# Altium schematic sheet 555 Timer.SchDoc: PCB Workshop
size A4; Revision: 1.1; SheetNumber: 1; SheetTotal: 1; Designer: Martin B; Project: PSAT; Design Name: 555 Timer; BoardRevision: 1.1; DesignName: 555 Timer
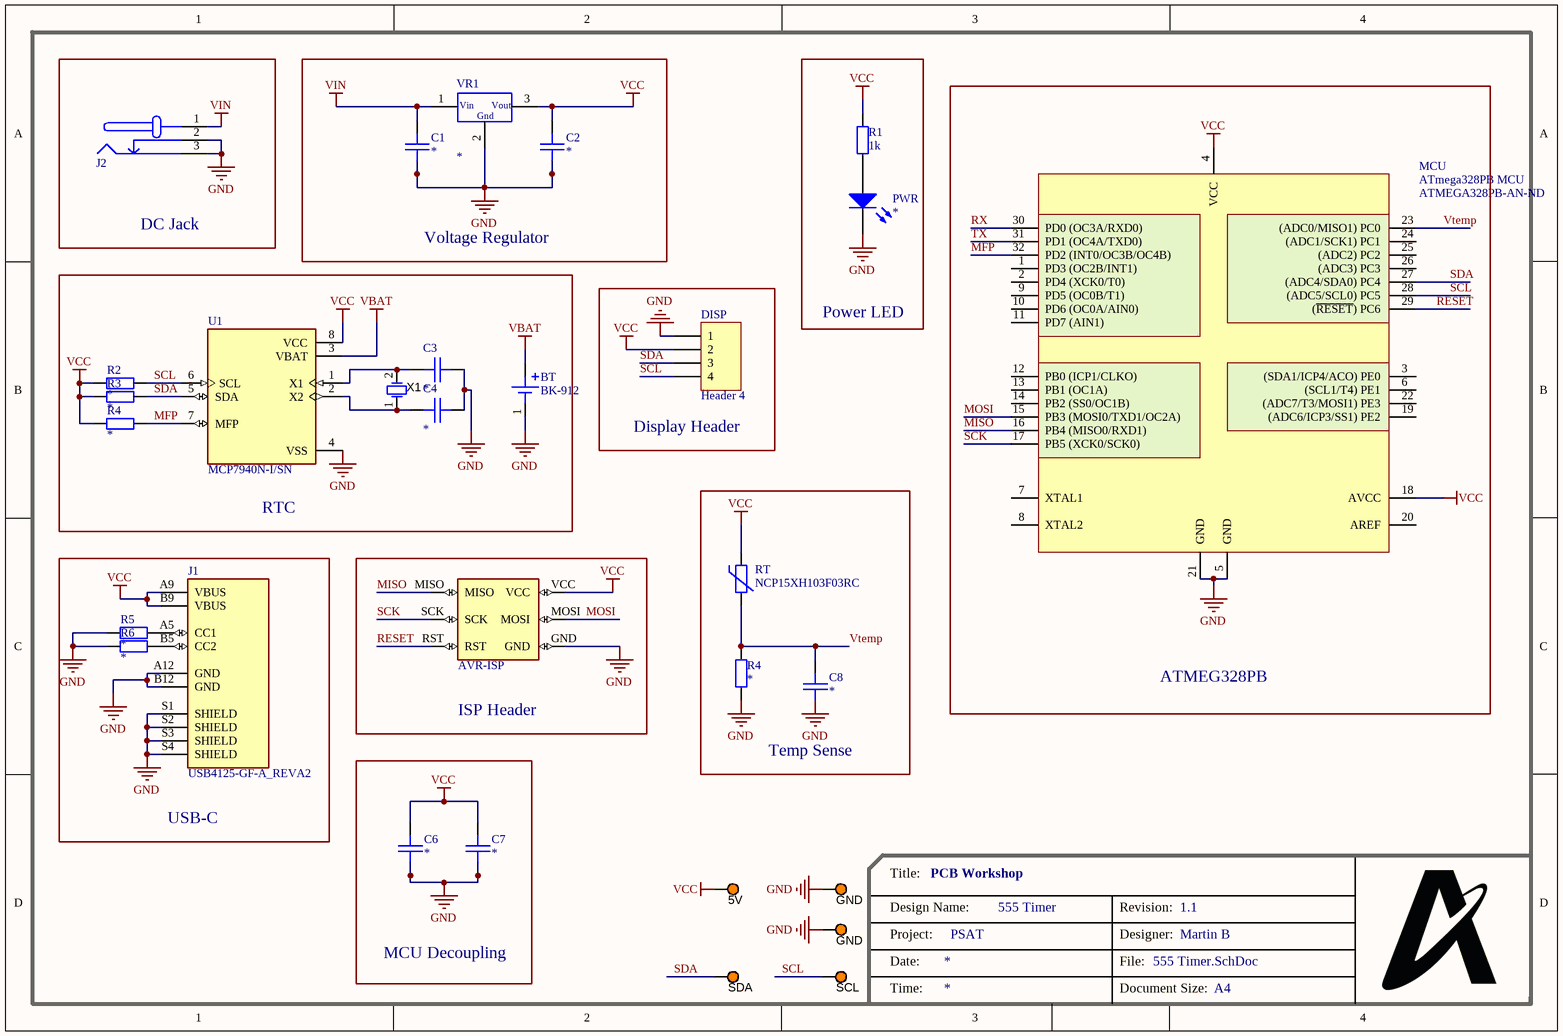
[diagram p0: 555 Timer.SchDoc]

## Parts
(Parts that share a designator on the sheet are numbered #1, #2 ... from top to bottom, then left to right.)
5V  5003  [TP_TH]  (value not drawn)
?  AVR-ISP  [AVR-ISP]
BT  BK-912  [BAT_BK-912]
C1  *  [0805 CAP]
C2  *  [0805 CAP]
C3  *  [0805 CAP]
C4  *  [0805 CAP]
C6  *  [0805 CAP]
C7  *  [0805 CAP]
C8  *  [0805 CAP]
DISP  Header 4  [ece-HDR1X4]
GND#1  5003  [TP_TH]  (value not drawn)
GND#2  5003  [TP_TH]  (value not drawn)
J1  USB4125-GF-A_REVA2  [GCT_USB4125-GF-A_REVA2]
J2  DC barrel jack  [AC-Socket]  (value not drawn)
MCU  ATmega328PB MCU  Supplier Part Number 1: ATMEGA328PB-AN-ND  [32 - TQFP]
PWR  *  [ECE-LED2012-0805SM]
R1  1k  [RESC2012-0805SM]
R2  *  [0805 RES]
R3  *  [0805 RES]
R4#1  *  [0805 RES]
R4#2  *  [0805 RES]
R5  *  [0805 RES]
R6  *  [0805 RES]
RT  NCP15XH103F03RC  [THRMC1005X55N]
SCL  5003  [TP_TH]  (value not drawn)
SDA  5003  [TP_TH]  (value not drawn)
U1  MCP7940N-I/SN  [SOIC127P600X175-8N]
VR1  *  [ece-TO220]
X1  ABS07-32.768KHz-T  [ABRA-ABS07-2_V]  (value not drawn)

## Blocks framed on the sheet
DC Jack: J2
Voltage Regulator: C1 C2 VR1
Power LED: PWR R1
ATMEG328PB: MCU
RTC: BT C3 C4 R2 R3 R4#1 U1 X1
Display Header: DISP
Temp Sense: C8 R4#2 RT
USB-C: J1 R5 R6
ISP Header: ?
MCU Decoupling: C6 C7

## Nets
GND: ?.GND BT.1(NEG) C1.2 C2.2 C3.2 C4.2 C6.2 C7.2 DISP.1 GND#1.1 GND#2.1 J1.A12(GND) J1.B12(GND) J1.S1(SHIELD) J1.S2(SHIELD) J1.S3(SHIELD) J1.S4(SHIELD) J2.2(GND_ALT) J2.3(GND) MCU.5(GND) MCU.21(GND) PWR.2(K) R4#2.1 R5.1 R6.1 U1.4(VSS) VR1.2(Gnd)
VBAT: BT.S1(POS) U1.3(VBAT)
VCC: 5V.1 ?.VCC C2.1 C6.1 C7.1 DISP.2 J1.A9(VBUS) J1.B9(VBUS) MCU.4(VCC) MCU.18(AVCC) R1.1 R2.1 R3.1 R4#1.1 RT.1 U1.8(VCC) VR1.3(Vout)
VIN: C1.1 J2.1(VCC) VR1.1(Vin)
MFP: MCU.32(PD2_(INT0/OC3B/OC4B)) R4#1.2 U1.7(MFP)
MISO: ?.MISO MCU.16(PB4_(MISO0/RXD1))
MOSI: ?.MOSI MCU.15(PB3_(MOSI0/TXD1/OC2A))
RESET: ?.RST MCU.29((~{RESET})_PC6)
RX: MCU.30(PD0_(OC3A/RXD0))
SCK: ?.SCK MCU.17(PB5_(XCK0/SCK0))
SCL: DISP.4 MCU.28((ADC5/SCL0)_PC5) R2.2 SCL.1 U1.6(SCL)
SDA: DISP.3 MCU.27((ADC4/SDA0)_PC4) R3.2 SDA.1 U1.5(SDA)
TX: MCU.31(PD1_(OC4A/TXD0))
Vtemp: C8.1 MCU.23((ADC0/MISO1)_PC0) R4#2.2 RT.2
NetC3_1: C3.1 U1.1(X1) X1.2(OSC2)
NetC4_1: C4.1 U1.2(X2) X1.1(OSC1)
NetJ1_A5: J1.A5(CC1) R5.2
NetJ1_B5: J1.B5(CC2) R6.2
NetPWR_1: PWR.1(A) R1.2

Not connected (* = marked no-connect by the designer): C8 2; MCU 1(PD3_(OC2B/INT1)_) 2(PD4_(XCK0/T0)_) 3((SDA1/ICP4/ACO)_PE0) 6((SCL1/T4)_PE1) 7(XTAL1) 8(XTAL2) 9(PD5_(OC0B/T1)_) 10(PD6_(OC0A/AIN0)_) 11(PD7_(AIN1)_) 12(PB0_(ICP1/CLKO)_) 13(PB1_(OC1A)_) 14(PB2_(SS0/OC1B)_) 19((ADC6/ICP3/SS1)_PE2) 20(AREF) 22((ADC7/T3/MOSI1)_PE3) 24((ADC1/SCK1)_PC1) 25((ADC2)_PC2) 26((ADC3)_PC3)

## Notes on the sheet
- Labels drawn without touching a wire or pin: GND
- Title:
- Design Name:
- Revision:
- Project:
- Date:
- Designer:
- File:
- Time:
- Document Size:
- A4

## Library data of the parts
5V GND#1 GND#2 SCL SDA = TestPoint: Test Point, Orange, 1-Pin THD, RoHS; Peak Reverse Current: 600 uA; Forward Current: 3 A; Max Surge Current: 80 A; Forward Voltage: 1.08 V; Max Operating Temperature: 150 degC; PackageReference: 5003; Pins: 2; ComponentLink2URL: http://keyelco.com/userAssets/file/M65p56.pdf; PackageDescription: 1-Pin Through Hole Device, Dia 2.54 mm; Weight: 0.01 lb; Diameter: 5.3 mm; Mount: Through Hole; Package Quantity: 500; Packaging: Bulk; Min Operating Temperature: -65 degC; ComponentLink1Description: Manufacturer URL; Height: 0.25 inch; ComponentLink1URL: http://www.keyelco.com/; ComponentLink2Description: Datasheet; Width: 0.25 inch; REACH SVHC: No SVHC; RoHSCompliant: true; Radiation Hardening: No; Length: 9.5 mm; DatasheetVersion: Jun-15
? = AVR-ISP: Emulators / Simulators AVR USB IN CIRCUIT EMUL/PRGMR ISP; MF: Gravitech; Package: None; MP: AVR-ISP; Availability: Unavailable; SnapEDA_Link: https://www.snapeda.com/parts/AVR-ISP/Gravitech/view-part/4593377/?ref=snap; Price: None; Value: *
BT = BK-912: BATTERY RETAINER COIN 20MM SMD; MF: MPD; Value: *; Price: None; Package: None; SnapEDA_Link: https://www.snapeda.com/parts/BK-912/Memory%20Protection%20Devices/view-part/4219672/?ref=snap; Availability: Unavailable; MP: BK-912
C1-C4 C6-C8 = CerCap_SMT_0805: SMT ceramic capacitor 0805 size; Value: *
DISP = Header 4: Header, 4-Pin; LatestRevisionDate: 17-Jul-2002; LatestRevisionNote: Re-released for DXP Platform.; Publisher: Altium Limited
J2 = DC_Input: DC barrel jack connection to AC source; Value: socket
MCU = ATmega328PB_SMT_TQFP32: IC MCU 8BIT 32KB FLASH 32TQFP; Manufacturer: Atmel; Manufacturer Part Number: ATMEGA328PB-AN; Core Processor: AVR; Core Size: 8-Bit; Speed: 20MHz; Connectivity: I²C, SPI, UART/USART; Peripherals: Brown-out Detect/Reset, POR, PWM, WDT; Number of I/O: 27; Program Memory Size: 32KB (16K x 16); EEPROM Size: 1K x 8; RAM Size: 2K x 8; Voltage - Supply (Vcc/Vdd): 1.8 V ~ 5.5 V; Data Converters: A/D 8x10b; Oscillator Type: Internal; Supplier 1: Digi-Key; RoHS: RoHS Compliant; Category: Integrated Circuits (ICs); Stock 1: 366; Pricing 1: 1=2.74, 10=2.448, 25=2.2032, 100=2.0074, 250=1.81152, 500=1.62548, 1000=1.37088 (USD); Packaging: Tray; Part Status: Active; Program Memory Type: FLASH; Operating Temperature: -40°C ~ 105°C (TA); Package / Case: 32-TQFP; Supplier Device Package: 32-TQFP (7x7); ComponentLink1URL: http://www.atmel.com/images/atmel-42397-8-bit-avr-microcontroller-atmega328pb_datasheet.pdf; ComponentLink1Description: http://www.atmel.com/images/atmel-42397-8-bit-avr-microcontroller-atmega328pb_datasheet.pdf
PWR = LED-SM0805: SMT LED; Manufacturer: Generic Components; Class I: Optoelectronic; Published: 8-Jun-2000; Revision: July-2002: Re-released for DXP Platform.; Publisher: Altium Limited; Class II: LED; Value: *
R1 = Res SM 0805: SM resistor; Value: *
R2 R3 R4#1 R4#2 R5 R6 = Res_SMT_0805: 0805 resistor; Published: 8-Jun-2000; LatestRevisionDate: 17-Jul-2002; LatestRevisionNote: Re-released for DXP Platform.; PackageReference: AXIAL-0.4; Publisher: Altium Limited; Value: *; ComponentLink1Description: https://nz.mouser.com/datasheet/2/315/AOA0000C304-1149620.pdf
RT = NCP15XH103F03RC: NTC Thermistor 10k 0402 (1005 Metric); MF: Murata; SnapEDA_Link: https://www.snapeda.com/parts/NCP15XH103F03RC/Murata/view-part/?ref=snap; Package: 1005 Taiyo Yuden; MP: NCP15XH103F03RC; Check_prices: https://www.snapeda.com/parts/NCP15XH103F03RC/Murata/view-part/?ref=eda; Value: *
U1 = MCP7940N-I/SN: Microchip MCP7940N-I/SN, Real Time Clock, 64B RAM Serial-I2C, 8-Pin SOIC | Microchip Technology Inc. MCP7940N-I/SN; SnapEDA_Link: https://www.snapeda.com/parts/MCP7940N-I/SN/Microchip/view-part/?ref=snap; Package: SO-8 Microchip; Value: *; MF: Microchip; MP: MCP7940N-I/SN; Check_prices: https://www.snapeda.com/parts/MCP7940N-I/SN/Microchip/view-part/?ref=eda
VR1 = VoltRegBig: Voltage Regulator; Value: *
X1 = CMP-003-00022-2: Low Profile Crystal, 32.768 kHz, +/- 20 ppm, 12.5 pF, -40 to 85 degC, 2-Pin SMD, Pb-Free, Tape and Reel; Manufacturer: Abracon; Frequency Tolerance: 20ppm; ESR: 70k; Load Capacitance: 12.5pF; Max Operating Temperature: 85°C; Mounting Technology: SM; Manufacturer URL: http://www.abracon.com/; Pins: 2; Packaging: TapeandReel; Tolerance: 20ppm; Min Operating Temperature: -40°C; Frequency: 32.768kHz; Datasheet URL: http://www.abracon.com/Resonators/ABS07.pdf; RoHS Compliant: True; Package Description: 2-Pin Surface Mount Device, Body 3.2 x 1.5 mm; Datasheet Version: Aug-15; Package Reference: ABS07-2; Package URL: http://www.abracon.com/Support/PackageDrawing/Resonators/ABS07.PDF; Package Quantity: 3000; Case/Package: CSMD
J1 = USB4125-GF-A_REVA2: Package: None; Availability: Unavailable; MP: USB4125-GF-A_REVA2; Value: *; Price: None